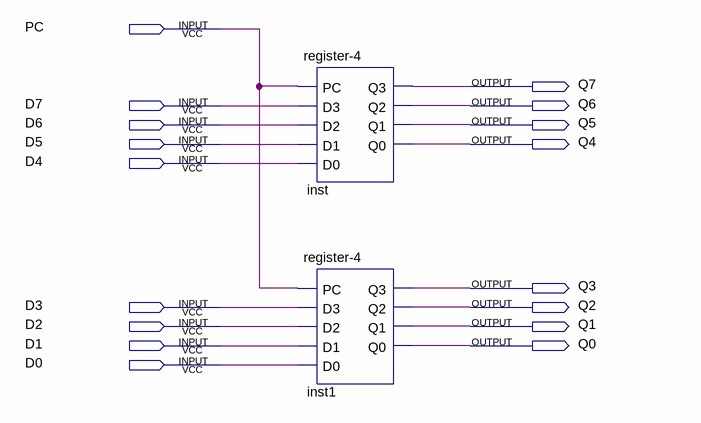
[diagram p0: schematic sheet]
// Quartus schematic register-8.bdf as structural Verilog: 2 symbols, 17 pins
module \register-8  (
  input  PC,
  input  D7,
  input  D6,
  input  D5,
  input  D4,
  input  D3,
  input  D2,
  input  D1,
  input  D0,
  output Q7,
  output Q6,
  output Q5,
  output Q4,
  output Q3,
  output Q2,
  output Q1,
  output Q0
);

  \register-4  inst (.PC(PC), .D3(D7), .D2(D6), .D1(D5), .D0(D4), .Q3(Q7), .Q2(Q6), .Q1(Q5), .Q0(Q4));
  \register-4  inst1 (.PC(PC), .D3(D3), .D2(D2), .D1(D1), .D0(D0), .Q3(Q3), .Q2(Q2), .Q1(Q1), .Q0(Q0));
endmodule
